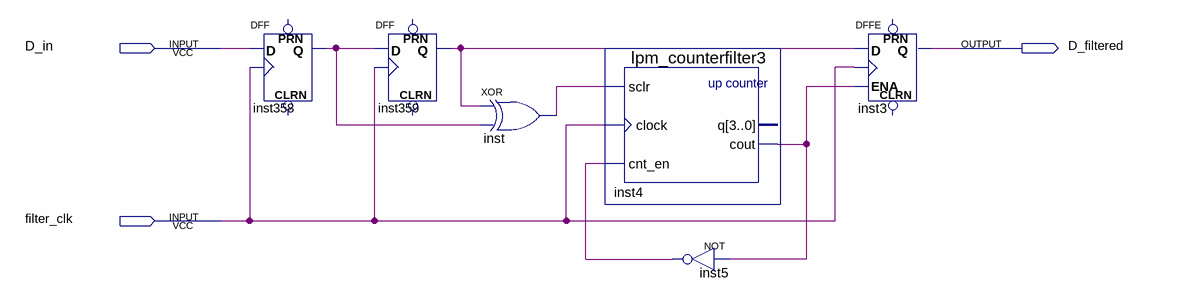
[diagram p0: schematic sheet]
// Quartus schematic debounce_filter.bdf as structural Verilog: 6 symbols, 3 pins
module debounce_filter (
  input  D_in,
  input  filter_clk,
  output D_filtered
);

  wire inst4_cout, inst5_out, inst358_q, inst359_q, inst_out;

  DFF inst358 (.CLK(filter_clk), .D(D_in), .Q(inst358_q));  // open: CLRN, PRN
  DFF inst359 (.CLK(filter_clk), .D(inst358_q), .Q(inst359_q));  // open: CLRN, PRN
  xor inst (inst_out, inst359_q, inst358_q);
  lpm_counterfilter3 inst4 (.sclr(inst_out), .clock(filter_clk), .cnt_en(inst5_out), .cout(inst4_cout));  // open: q
  not inst5 (inst5_out, inst4_cout);
  DFFE inst3 (.D(inst359_q), .CLK(filter_clk), .ENA(inst4_cout), .Q(D_filtered));  // open: PRN, CLRN
endmodule
